# Altium project Soldering_Station_V2.0.PrjPcb
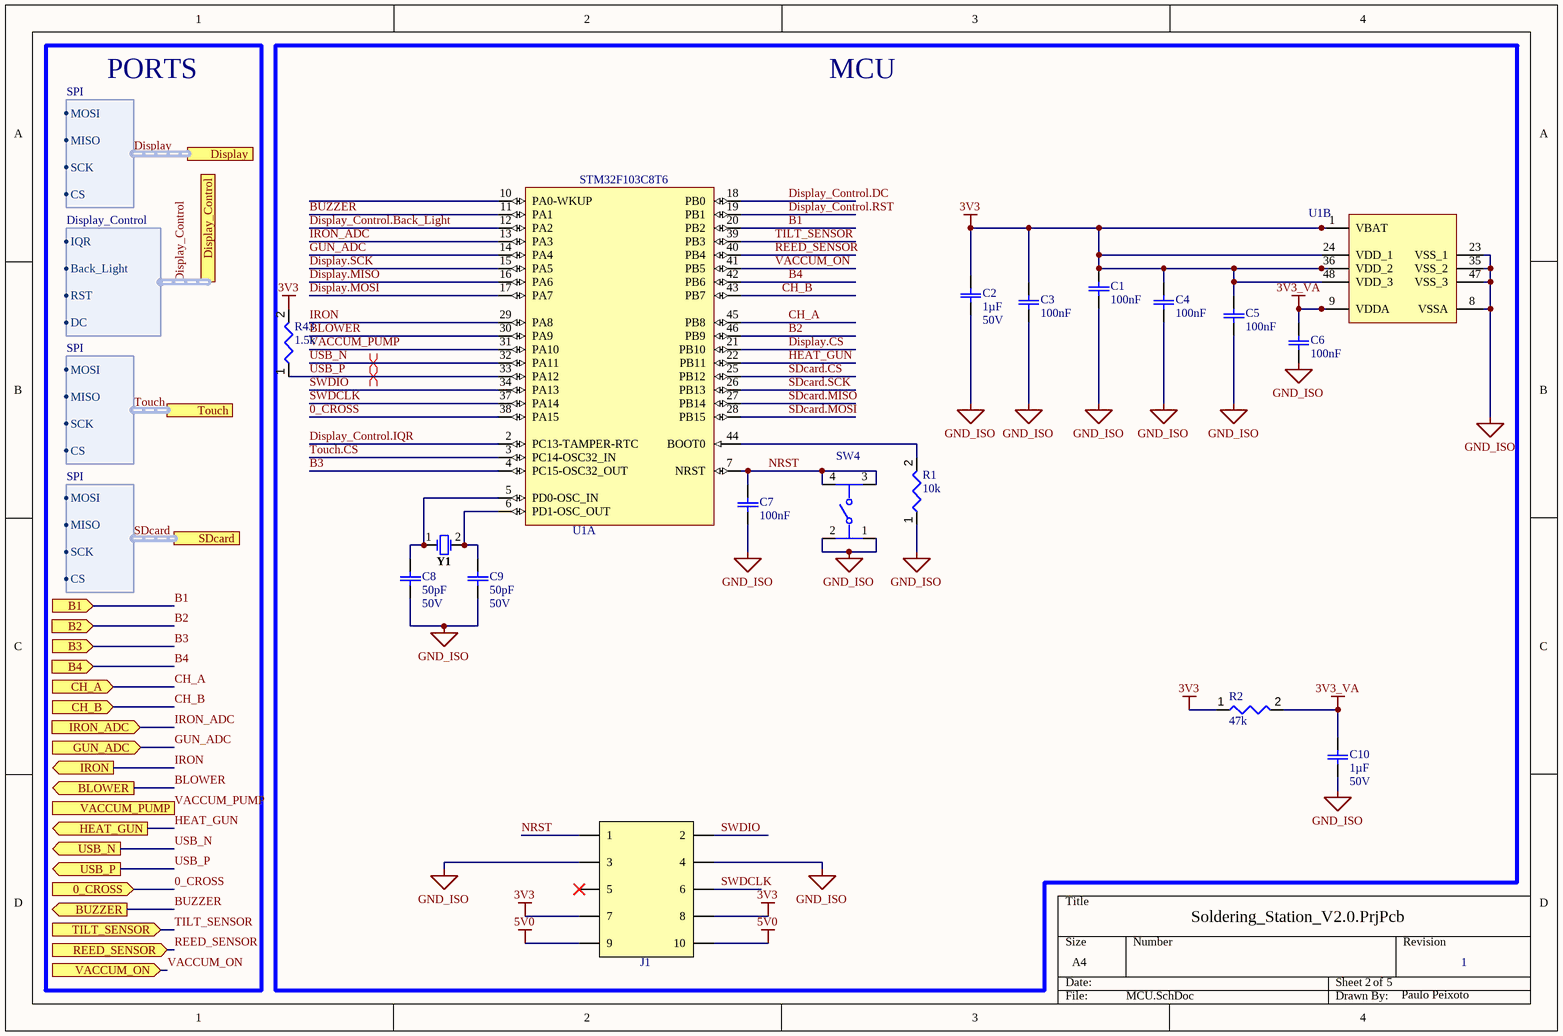
[diagram p0: MCU.SchDoc]
3 sheets, 72 parts. Net scope: flat (ports and power ports of the same name join across sheets).
Board file: PCB1.PcbDoc
Sheets:
  MCU.SchDoc
  Connectivity.SchDoc
  Temperature_Sensing.SchDoc

## Sheet MCU.SchDoc: Soldering Station
size A4; Author: Paulo Peixoto; Revision: 1; SheetNumber: 2; SheetTotal: 5

### Parts
C1  value 100nF  [Generic Ceramic 0402 CAP]  (hidden comment: CAP-MLCC_SMD-0402_MR-GCM_n_100nF_50V_10%_X7R)
C2  value 1µF  Voltage Rating: 50V  [Generic Ceramic 0603 CAP]  (hidden comment: CAP-MLCC_SMD-0603_MR-GRT_u_1uF_50V_10%_X5R)
C3  value 100nF  [Generic Ceramic 0402 CAP]  (hidden comment: CAP-MLCC_SMD-0402_MR-GCM_n_100nF_50V_10%_X7R)
C4  value 100nF  [Generic Ceramic 0402 CAP]  (hidden comment: CAP-MLCC_SMD-0402_MR-GCM_n_100nF_50V_10%_X7R)
C5  value 100nF  [Generic Ceramic 0402 CAP]  (hidden comment: CAP-MLCC_SMD-0402_MR-GCM_n_100nF_50V_10%_X7R)
C6  value 100nF  [Generic Ceramic 0402 CAP]  (hidden comment: CAP-MLCC_SMD-0402_MR-GCM_n_100nF_50V_10%_X7R)
C7  value 100nF  [Generic Ceramic 0402 CAP]  (hidden comment: CAP-MLCC_SMD-0402_MR-GCM_n_100nF_50V_10%_X7R)
C8  value 50pF  Voltage Rating: 50V  [Generic Ceramic 0603 CAP]  (hidden comment: CAP-MLCC_SMD-0603_YGE-CC_p_50pF_50V_5%_C0G)
C9  value 50pF  Voltage Rating: 50V  [Generic Ceramic 0603 CAP]  (hidden comment: CAP-MLCC_SMD-0603_YGE-CC_p_50pF_50V_5%_C0G)
C10  value 1µF  Voltage Rating: 50V  [Generic Ceramic 0603 CAP]  (hidden comment: CAP-MLCC_SMD-0603_MR-GRT_u_1uF_50V_10%_X5R)
J1  302-S101  [FP-302-S101-MFG]  (value not drawn)
R1  value 10k  [Generic_0603_RES]  (hidden comment: RES-TK_SMD-0603_VIS-CRCW_K_10K_1/10W_1%)
R2  value 47k  [Generic_0603_RES]  (hidden comment: RES-TK_SMD-0603_VIS-CRCW_K_47K_1/10W_1%)
R43  value 1.5k  [Generic_0402__RES]  (hidden comment: RES-TK_SMD-0402_VIS-CRCW_K_1.5K_1/10W_1%)
SW4  TL1105AF160Q  [FP-TL1105AF160Q-MFG]  (value not drawn)
U1  STM32F103C8T6  [STM-LQFP48_L]  (parts A,B of 2)
Y1  FOXSLF/080-20  [FOX-FOXSLF080-20]  (value not drawn)

### Blocks framed on the sheet
MCU: C1-C10 J1 R1 R2 R43 SW4 U1 Y1

### Ports
0_CROSS (in, see 1[6B], 4[1B]), B1 (in, see 1[4B], 3[1B]), B2 (in, see 1[4B], 3[1B]), B3 (in, see 1[4B], 3[1B]), B4 (in, see 1[4B], 3[1B]), BLOWER (out, see 1[6B], 4[1A]), BUZZER (out, see 1[4B], 3[1C]), CH_A (in, see 1[4B], 3[1B]), CH_B (in, see 1[4B], 3[1C]), Display (harness SPI, see 1[5B], 3[1A]), Display_Control (harness Display_Control, see 1[5B], 3[2A]), GUN_ADC (in, see 1[4C], 5[4C]), HEAT_GUN (out, see 1[6B], 4[1A]), IRON (out, see 1[6B], 4[1A]), IRON_ADC (in, see 1[4C], 5[4A]), REED_SENSOR (in, see 1[5C]), SDcard (harness SPI, see 1[5B], 3[1B]), TILT_SENSOR (in, see 1[5C]), Touch (harness SPI, see 1[5B], 3[1B]), USB_N (out, see 1[4B], 3[1C]), USB_P (out, see 1[4B], 3[1C]), VACCUM_ON (in, see 1[5C]), VACCUM_PUMP (out, see 1[6B], 4[1A])

### Harnesses
SPI: MOSI, MISO, SCK, CS
Display_Control: IQR, Back_Light, RST, DC

### Nets
3V3: C1.2 C2.2 C3.2 C4.2 C5.2 J1.7 J1.8 R2.1 R43.2 U1.1(VBAT) U1.24(VDD_1) U1.36(VDD_2) U1.48(VDD_3)
3V3_VA: C6.2 C10.2 R2.2 U1.9(VDDA)
5V0: J1.9 J1.10
GND_ISO: C1.1 C2.1 C3.1 C4.1 C5.1 C6.1 C7.1 C8.2 C9.2 C10.1 J1.3 J1.4 R1.1 SW4.1 SW4.2 U1.8(VSSA) U1.23(VSS_1) U1.35(VSS_2) U1.47(VSS_3)
0_CROSS: U1.38(PA15) ; port 0_CROSS
B1: U1.20(PB2) ; port B1
B2: U1.46(PB9) ; port B2
B3: U1.4(PC15-OSC32_OUT) ; port B3
B4: U1.42(PB6) ; port B4
BLOWER: U1.30(PA9) ; port BLOWER
BUZZER: U1.11(PA1) ; port BUZZER
CH_A: U1.45(PB8) ; port CH_A
CH_B: U1.43(PB7) ; port CH_B
Display.CS: U1.21(PB10)
Display.MISO: U1.16(PA6)
Display.MOSI: U1.17(PA7)
Display.SCK: U1.15(PA5)
Display_Control.Back_Light: U1.12(PA2)
Display_Control.DC: U1.18(PB0)
Display_Control.IQR: U1.2(PC13-TAMPER-RTC)
Display_Control.RST: U1.19(PB1)
GUN_ADC: U1.14(PA4) ; port GUN_ADC
HEAT_GUN: U1.22(PB11) ; port HEAT_GUN
IRON: U1.29(PA8) ; port IRON
IRON_ADC: U1.13(PA3) ; port IRON_ADC
NRST: C7.2 J1.1 SW4.3 SW4.4 U1.7(NRST)
REED_SENSOR: U1.40(PB4) ; port REED_SENSOR
SDcard.CS: U1.25(PB12)
SDcard.MISO: U1.27(PB14)
SDcard.MOSI: U1.28(PB15)
SDcard.SCK: U1.26(PB13)
SWDCLK: J1.6 U1.37(PA14)
SWDIO: J1.2 U1.34(PA13)
TILT_SENSOR: U1.39(PB3) ; port TILT_SENSOR
Touch.CS: U1.3(PC14-OSC32_IN)
USB_N: U1.32(PA11) ; port USB_N
USB_P: R43.1 U1.33(PA12) ; port USB_P
VACCUM_ON: U1.41(PB5) ; port VACCUM_ON
VACCUM_PUMP: U1.31(PA10) ; port VACCUM_PUMP
NetC8_1: C8.1 U1.5(PD0-OSC_IN) Y1.1
NetC9_1: C9.1 U1.6(PD1-OSC_OUT) Y1.2
NetR1_2: R1.2 U1.44(BOOT0)

Not connected (* = marked no-connect by the designer): J1 5*; U1 10(PA0-WKUP)

### Buses and harness runs
harness Display = port Display
harness Display_Control = port Display_Control
harness SDcard = port SDcard
harness Touch = port Touch

### Layout directives
differential pair: USB_N, USB_P

### Notes on the sheet
- PORTS

### Library data of the parts
C1 C3-C7 = CMP-001-00170-1: Ceramic Capacitor, Ceramic, 50V, 10% +Tol, 10% -Tol, X7R, 15% TC, 0.1uF, Surface Mount, 0402; Mounting Technology: Surface Mount; RoHS Compliant: Yes; Capacitor Type: Ceramic; Min Operating Temperature: -55°C; Case/Package: 0402; Max Operating Temperature: 125°C; Pins: 2
C2 C10 = CMP-001-00191-2: Multilayer Ceramic Capacitors MLCC - SMD/SMT 0603 50Vdc 1.0uF X5R 10%; Case/Package: 0603; Tolerance: 10%; Min Operating Temperature: -55°C; Capacitor Type: Ceramic; Pins: 2; RoHS Compliant: Yes; Mounting Technology: Surface Mount; Automotive: AEQ-200; Max Operating Temperature: 85°C; Dielectric: X5R
C8 C9 = CMP-001-00198-1: Surface Mount Ceramic Multilayer Capacitor 50pF 5% C0G 50V 0603 Paper T/R; Dielectric: COG; Case/Package: 0603; Min Operating Temperature: -55°C; RoHS Compliant: Yes; Automotive: NONE; Capacitor Type: Ceramic; Mounting Technology: Surface Mount; Max Operating Temperature: 125°C; Pins: 2
J1 = CMP-001-0100-1: Conn Shrouded Header (4 Sides) HDR 10 POS 2.54mm Solder ST Thru-Hole; Current Rating: 3A; Connector Type: Male Pin; Number of Contacts: 10; Contact Resistance: 20mΩ; Insulation Resistance: 1GΩ; Terminal Pitch: 2.54mm; RoHS: Compliant; REACH SVHC: Yes; Contact Gender: Male; Row Spacing: 2.54mm; Contact Material: Brass; Number of Rows: 2; Max Operating Temperature: 105°C; Color: Black; Pitch: 2.54mm; Contact Plating: Gold; Number of Positions: 10; Termination: Solder; Mounting Technology: Through Hole; Lifecycle Status: Production; Min Operating Temperature: -40°C; Pins: 10; Height: 9.15mm
R1 = CMP-009-00246-1: Fixed Resistor, Metal Glaze/thick Film, 0.1W, 10000ohm, 75V, 1% +/-Tol, 100ppm/Cel, Surface Mount, 0603; Power: 100mW; Mounting Technology: Surface Mount; Pins: 2; Min Operating Temperature: -55°C; Tolerance: 1%; RoHS Compliant: Yes; Max Operating Temperature: 155°C; Case/Package: 0603; Voltage Rating: 75V
R2 = CMP-009-00207-2: Fixed Resistor, Metal Glaze/thick Film, 0.1W, 47000ohm, 75V, 1% +/-Tol, 100ppm/Cel, Surface Mount, 0603; Power: 100mW; Case/Package: 0603; Max Operating Temperature: 155°C; Voltage Rating: 75V; RoHS Compliant: Yes; Min Operating Temperature: -55°C; Tolerance: 1%; Mounting Technology: Surface Mount; Pins: 2
R43 = CMP-009-00006-1: Surface Mount Thick Film Resistor, AEC-Q200 CRCW Series, 1.5 kohm, 125 mW, - 1%, 50 V; Power Rating: 125mW; Voltage Rating: 50V; Pins: 2; Case Code (Imperial): 0402; Max Operating Temperature: 155°C; Composition: Thick Film; REACH SVHC: Unknown; RoHS: Compliant; Min Operating Temperature: -55°C; Tolerance: 1%; Voltage Rating (DC): 50V; Case Code (Metric): 1005; Packaging: Cut Tape; Width: 1mm; Lead Free: Lead Free; Case/Package: 0402
SW4 = CMP-17879-000016-1: SWITCH TACTILE SPST-NO 0.05A 12V; Mechanical Life: 100000Cycles; Contact Current Rating: 50mA; Contact Resistance: 100mR; Switch Function: Off-Mom; Actuator Type: Standard; Actuator Length: 1.4mm; Max Voltage Rating (DC): 50V; Throw Configuration: SPST; Actuator Material: Nylon; Illumination Type: Non-Illuminated; Switch Travel: 0.25mm; Operating Force: 160gf; Package Quantity: 750; Width: 6mm; Series: TL1105; Voltage Rating (DC): 12V; Length: 6mm; Contact Plating: Silver; Color: Black; Housing Material: Nylon; Min Operating Temperature: -20°C; Lead Free: Lead Free; Mount: Through Hole; Termination: PC Pin; RoHS Compliant: Yes; Orientation: Straight; Max Operating Temperature: 70°C; Reach SVHC Compliant: Yes; Packaging: Bulk; Electrical Life: 100000Cycles; Current Rating: 50mA; Contact Material: Bronze; Size: 6mm
U1 = CMP-0237-00215-3: ARM Cortex-M3 32-bit MCU, 64 KB Flash, 20 KB Internal RAM, 37 I/Os, 48-pin LQFP, -40 to 85 degC, Tray; Supply Voltage(Vcc) min (V): 2; Internal RAM Size (kB): 20; FLASH Size (Prog) (kB): 64; A/D Converter: 2x12-bit (10 Channel); I/Os (High Current): 37; Operating Frequency(F) (Processor speed) (MHz): 72; Core: ARM Cortex-M3; ComponentLink3Description: Package Specification; Mounting Technology: Surface Mount; PartNumber: STM32F103C8T6; PackageReference: LQFP48; Packing: Tray; ComponentLink3URL: http://www.st.com/st-web-ui/static/active/en/resource/technical/document/datasheet/DM00058181.pdf; DatasheetVersion: Rev. 16; ComponentLink1URL: http://www.st.com/web/en/home.html; PackageVersion: Rev. 6, 06/2013; ComponentLink2URL: http://www.st.com/st-web-ui/static/active/en/resource/technical/document/datasheet/CD00161566.pdf; ComponentLink1Description: Manufacturer URL; ComponentLink2Description: Datasheet; PackageDescription: 48-Pin Low Profile Quad Flat Package, 7 x 7 mm Body, 0.5 mm Pitch
Y1 = CMP-1749-00002-1: Resistance Weld Thru-Hole Crystal, 8 MHz, -20 to 70 degC, 2-Pin THD, RoHS, Bulk; Dropout Voltage: 2 V; Outputs: 1; Nominal Output Voltage: 5 V; Min Input Voltage: 7 V; Case\Package: TO-263-3; Max Input Voltage: 35 V; Max Ouput Current: 1 A; Length: 10.24 mm; Max Operating Temperature: 125 degC; Mount: Surface Mount; PackageDescription: 2-Pin Through Hole Device, Body 11.35 x 4.65 mm; Package Quantity: 50; Pins: 3; ComponentLink2URL: http://download.siliconexpert.com/pdfs/2015/4/5/6/5/7/200/fox_/manual/35607121449963728hc49slf.pdf; PackageReference: FOXSLF080-20; Min Operating Temperature: 0 degC; Height: 30.02 mm; Packaging: Rail/Tube; Radiation Hardening: No; Width: 9.35 mm; ComponentLink1URL: http://www.foxonline.com/; DatasheetVersion: Mar-15; ComponentLink1Description: Manufacturer URL; Output Voltage: 5 V; RoHSCompliant: true; REACH SVHC: No SVHC; Output Current: 1 A; ComponentLink2Description: Datasheet

## Sheet Connectivity.SchDoc: =@Title
size A3; Author: Paulo Peixoto; DrawnBy: Paulo Peixoto; Engineer: Paulo Peixoto; SheetNumber: 3; SheetTotal: 5
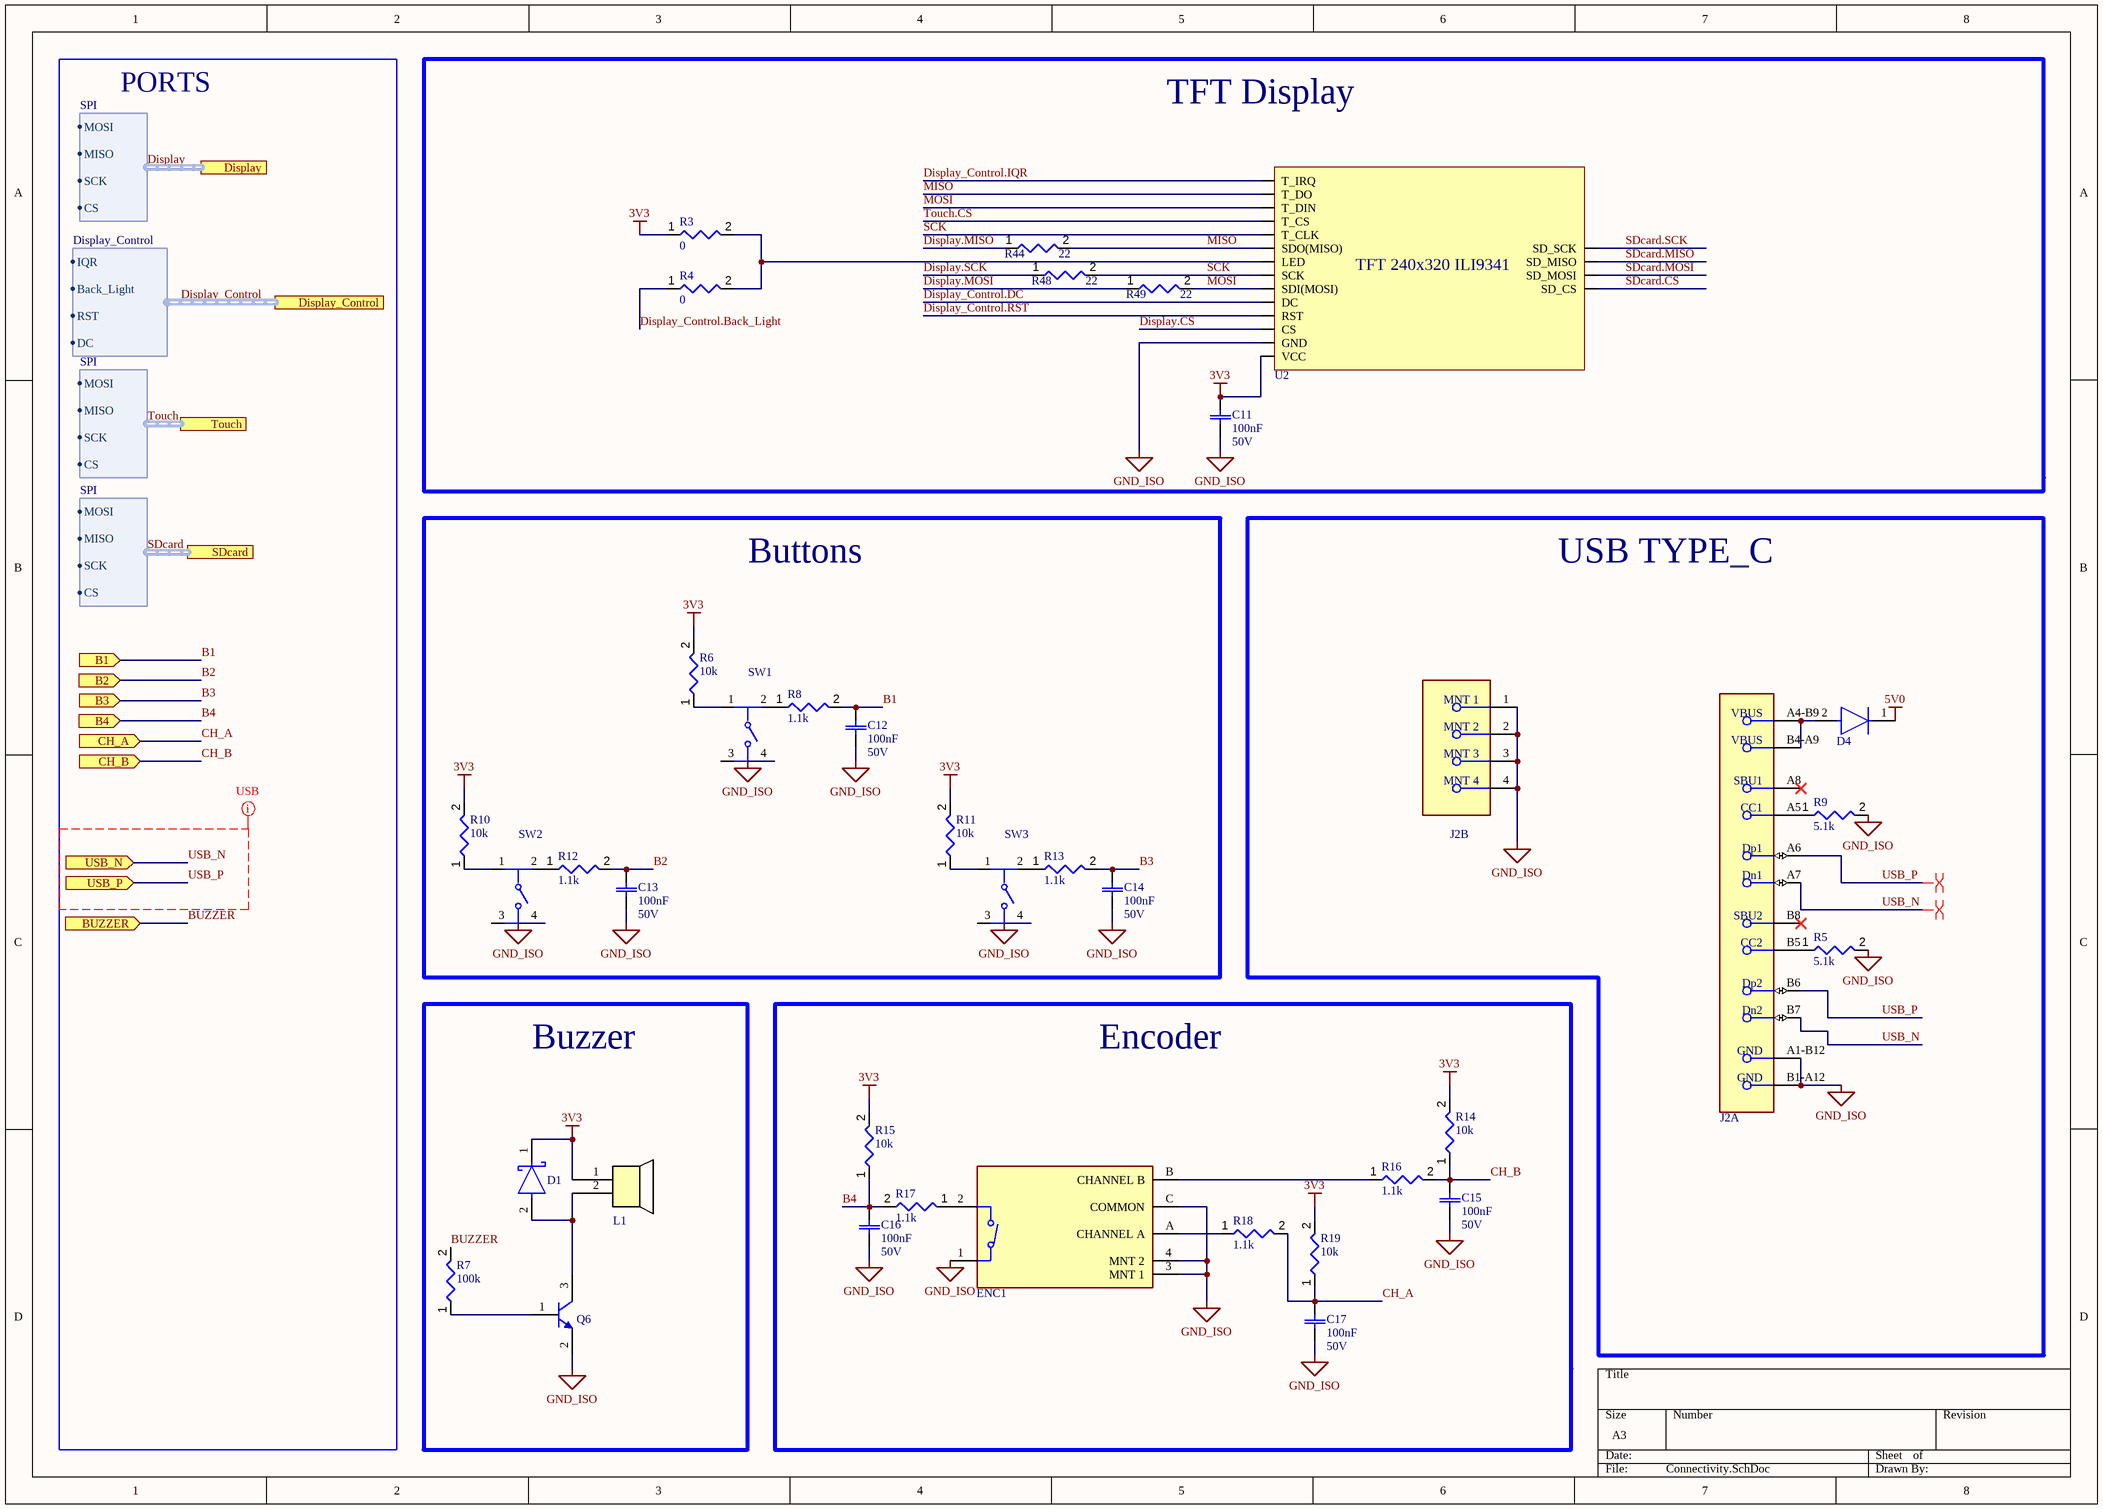
[diagram p1: Connectivity.SchDoc]

### Parts
C11  value 100nF  Voltage Rating: 50V  [Generic Ceramic 0603 CAP]  (hidden comment: CAP-MLCC_SMD-0603_MR-GCM_u_0.1uF_50V_10%_X8L)
C12  value 100nF  Voltage Rating: 50V  [Generic Ceramic 0603 CAP]  (hidden comment: CAP-MLCC_SMD-0603_MR-GCM_u_0.1uF_50V_10%_X8L)
C13  value 100nF  Voltage Rating: 50V  [Generic Ceramic 0603 CAP]  (hidden comment: CAP-MLCC_SMD-0603_MR-GCM_u_0.1uF_50V_10%_X8L)
C14  value 100nF  Voltage Rating: 50V  [Generic Ceramic 0603 CAP]  (hidden comment: CAP-MLCC_SMD-0603_MR-GCM_u_0.1uF_50V_10%_X8L)
C15  value 100nF  Voltage Rating: 50V  [Generic Ceramic 0603 CAP]  (hidden comment: CAP-MLCC_SMD-0603_MR-GCM_u_0.1uF_50V_10%_X8L)
C16  value 100nF  Voltage Rating: 50V  [Generic Ceramic 0603 CAP]  (hidden comment: CAP-MLCC_SMD-0603_MR-GCM_u_0.1uF_50V_10%_X8L)
C17  value 100nF  Voltage Rating: 50V  [Generic Ceramic 0603 CAP]  (hidden comment: CAP-MLCC_SMD-0603_MR-GCM_u_0.1uF_50V_10%_X8L)
D1  DIO-SHOTTKY_SMD_OD-214AC_TWS-1A_100V  [DIO-SHOTTKY_SMD_OD-214AC_TWS-1A_100V-Footprint-1]  (value not drawn)
D4  RS1A  [FP-403AE-MFG]  (value not drawn)
ENC1  PEC11R-4020F-S0012  [FP-PEC11R-4020F-S0012-MFG]  (value not drawn)
J2  217179-0001  [FP-2171790001-MFG]  (value not drawn)  (parts A,B of 2)
L1  TMB12A05  [TMB12A05-Footprint-1]  (value not drawn)
Q6  SMMBT2222ALT1G  [ONSC-SOT-23-3-318-08_V]  (value not drawn)
R3  value 0  [Generic_0603_RES]  (hidden comment: RES-TK_SMD-0603_VIS-CRCW_R_0R_1/10W_1%)
R4  value 0  [Generic_0603_RES]  (hidden comment: RES-TK_SMD-0603_VIS-CRCW_R_0R_1/10W_1%)
R5  value 5.1k  [Generic_0603_RES]  (hidden comment: RES-TK_SMD-0603_VIS-CRCW_K_5.1K_1/10W_1%)
R6  value 10k  [Generic_0603_RES]  (hidden comment: RES-TK_SMD-0603_VIS-CRCW_K_10K_1/10W_1%)
R7  value 100k  [Generic_0603_RES]  (hidden comment: RES-TK_SMD-0603_VIS-CRCW_K_100K_1/10W_1%)
R8  value 1.1k  [Generic_0603_RES]  (hidden comment: RES-TK_SMD-0603_VIS-CRCW_K_1.1K_1/10W_1%)
R9  value 5.1k  [Generic_0603_RES]  (hidden comment: RES-TK_SMD-0603_VIS-CRCW_K_5.1K_1/10W_1%)
R10  value 10k  [Generic_0603_RES]  (hidden comment: RES-TK_SMD-0603_VIS-CRCW_K_10K_1/10W_1%)
R11  value 10k  [Generic_0603_RES]  (hidden comment: RES-TK_SMD-0603_VIS-CRCW_K_10K_1/10W_1%)
R12  value 1.1k  [Generic_0603_RES]  (hidden comment: RES-TK_SMD-0603_VIS-CRCW_K_1.1K_1/10W_1%)
R13  value 1.1k  [Generic_0603_RES]  (hidden comment: RES-TK_SMD-0603_VIS-CRCW_K_1.1K_1/10W_1%)
R14  value 10k  [Generic_0603_RES]  (hidden comment: RES-TK_SMD-0603_VIS-CRCW_K_10K_1/10W_1%)
R15  value 10k  [Generic_0603_RES]  (hidden comment: RES-TK_SMD-0603_VIS-CRCW_K_10K_1/10W_1%)
R16  value 1.1k  [Generic_0603_RES]  (hidden comment: RES-TK_SMD-0603_VIS-CRCW_K_1.1K_1/10W_1%)
R17  value 1.1k  [Generic_0603_RES]  (hidden comment: RES-TK_SMD-0603_VIS-CRCW_K_1.1K_1/10W_1%)
R18  value 1.1k  [Generic_0603_RES]  (hidden comment: RES-TK_SMD-0603_VIS-CRCW_K_1.1K_1/10W_1%)
R19  value 10k  [Generic_0603_RES]  (hidden comment: RES-TK_SMD-0603_VIS-CRCW_K_10K_1/10W_1%)
R44  value 22  [Generic_0603_RES]  (hidden comment: RES-TK_SMD-0603_VIS-CRCW_R_22R_1/10W_1%)
R48  value 22  [Generic_0603_RES]  (hidden comment: RES-TK_SMD-0603_VIS-CRCW_R_22R_1/10W_1%)
R49  value 22  [Generic_0603_RES]  (hidden comment: RES-TK_SMD-0603_VIS-CRCW_R_22R_1/10W_1%)
SW1  TL1105AF160Q  [FP-TL1105AF160Q-MFG]  (value not drawn)
SW2  TL1105AF160Q  [FP-TL1105AF160Q-MFG]  (value not drawn)
SW3  TL1105AF160Q  [FP-TL1105AF160Q-MFG]  (value not drawn)
U2  TFT 240x320 SPI  [TFT ILI9341 2.4inch]  (value not drawn)

### Blocks framed on the sheet
TFT Display: C11 R3 R4 R44 R48 R49 U2
Buttons: C12-C14 R6 R8 R10-R13 SW1-SW3
USB TYPE_C: D4 J2 R5 R9
Buzzer: D1 L1 Q6 R7
Encoder: C15-C17 ENC1 R14-R19

### Ports
B1 (in, see 1[4B], 2[1C]), B2 (in, see 1[4B], 2[1C]), B3 (in, see 1[4B], 2[1C]), B4 (in, see 1[4A], 2[1C]), BUZZER (in, see 1[4B], 2[1D]), CH_A (in, see 1[4A], 2[1C]), CH_B (in, see 1[4A], 2[1C]), Display (harness SPI, see 1[5B], 2[1A]), Display_Control (harness Display_Control, see 1[5B], 2[1B]), SDcard (harness SPI, see 1[5B], 2[1C]), Touch (harness SPI, see 1[5B], 2[1B]), USB_N (in, see 1[4A], 2[1D]), USB_P (in, see 1[4A], 2[1D])

### Harnesses
SPI: MOSI, MISO, SCK, CS
Display_Control: IQR, Back_Light, RST, DC

### Nets
3V3: C11.2 D1.1(C) L1.1 R3.1 R6.2 R10.2 R11.2 R14.2 R15.2 R19.2 U2.1(VCC)
5V0: D4.1(C)
GND_ISO: C11.1 C12.1 C13.1 C14.1 C15.1 C16.1 C17.1 ENC1.1 ENC1.3(MNT_1) ENC1.4(MNT_2) ENC1.C(COMMON) J2.1(MNT_1) J2.2(MNT_2) J2.3(MNT_3) J2.4(MNT_4) J2.A1-B12(GND) J2.B1-A12(GND) Q6.2(E) R5.2 R9.2 SW1.4 SW2.4 SW3.4 U2.2(GND)
B1: C12.2 R8.2 ; port B1
B2: C13.2 R12.2 ; port B2
B3: C14.2 R13.2 ; port B3
B4: C16.2 R15.1 R17.2 ; port B4
BUZZER: R7.2 ; port BUZZER
CH_A: C17.2 R18.2 R19.1 ; port CH_A
CH_B: C15.2 R14.1 R16.2 ; port CH_B
Display.CS: U2.3(CS)
Display.MISO: R44.1
Display.MOSI: R49.1
Display.SCK: R48.1
Display_Control.Back_Light: R4.1
Display_Control.DC: U2.5(DC)
Display_Control.IQR: U2.14(T_IRQ)
Display_Control.RST: U2.4(RST)
MISO: R44.2 U2.9(SDO(MISO)) U2.13(T_DO)
MOSI: R49.2 U2.6(SDI(MOSI)) U2.12(T_DIN)
SCK: R48.2 U2.7(SCK) U2.10(T_CLK)
SDcard.CS: U2.18(SD_CS)
SDcard.MISO: U2.16(SD_MISO)
SDcard.MOSI: U2.17(SD_MOSI)
SDcard.SCK: U2.15(SD_SCK)
Touch.CS: U2.11(T_CS)
USB_N: J2.A7(Dn1) J2.B7(Dn2) ; port USB_N
USB_P: J2.A6(Dp1) J2.B6(Dp2) ; port USB_P
NetD1_2: D1.2(A) L1.2 Q6.3(C)
NetD4_2: D4.2(A) J2.A4-B9(VBUS) J2.B4-A9(VBUS)
NetENC1_2: ENC1.2 R17.1
NetENC1_A: ENC1.A(CHANNEL_A) R18.1
NetENC1_B: ENC1.B(CHANNEL_B) R16.1
NetJ2_A5: J2.A5(CC1) R9.1
NetJ2_B5: J2.B5(CC2) R5.1
NetQ6_1: Q6.1(B) R7.1
NetR3_2: R3.2 R4.2 U2.8(LED)
NetR6_1: R6.1 SW1.1
NetR8_1: R8.1 SW1.2
NetR10_1: R10.1 SW2.1
NetR11_1: R11.1 SW3.1
NetR12_1: R12.1 SW2.2
NetR13_1: R13.1 SW3.2

Not connected (* = marked no-connect by the designer): J2 A8(SBU1)* B8(SBU2)*; SW1 3; SW2 3; SW3 3

### Buses and harness runs
harness Display = port Display
harness Display_Control = port Display_Control
harness SDcard = port SDcard
harness Touch = port Touch

### Layout directives
differential pair: USB_N, USB_P
net class USB: USB_N, USB_P

### Notes on the sheet
- PORTS
- (in symbol CMP-001-0162-3) TFT 240x320 ILI9341

### Library data of the parts
C11-C17 = CMP-001-00115-11: Ceramic Capacitor, Multilayer, Ceramic, 50V, 10% +Tol, 10% -Tol, X8L, -40/+15% TC, 0.1uF, Surface Mount, 0603; Automotive: AEQ-200; Min Operating Temperature: -55°C; Case/Package: 0603; Mounting Technology: Surface Mount; RoHS Compliant: Yes; Capacitor Type: Ceramic; Pins: 2; Max Operating Temperature: 150°C
D1 = CMP-001-0168-2: Rectifier Diode, Schottky, 1 Phase, 1 Element, 1A, 100V V(RRM), Silicon, DO-214AC; Manufacturer Lifecycle Status: ACTIVE; Manufacturer Part Number: SS110; Peak Reverse Current: 2mA; Peak Non-Repetitive Surge Current: 40A; Element Configuration: Single; Forward Voltage: 800mV; Rep Pk Reverse Voltage-Max: 150V; Number of Elements: 1; Reference Standard: AEC-Q101; Max Repetitive Reverse Voltage (Vrrm): 100V; Mounting Technology: Surface Mount; REACH SVHC: No; Case/Package: SMA; Reach SVHC Compliant: Yes; Max Operating Temperature: 150°C; Height: 2.3mm; Lifecycle Status: Production; Length: 4.6mm; Max Forward Surge Current (Ifsm): 40A; Min Operating Temperature: -55°C; Width: 2.83mm; RoHS Compliant: Yes; Forward Current: 1A; Max Output current: 1A; Reverse Standoff Voltage: 100V; Number of Terminals: 2; RoHS: Compliant; Pins: 2
D4 = CMP-001-0173-1: Diode Fast Recovery Rectifier 50V 1A 2-Pin DO-214AC T/R; Manufacturer Lifecycle Status: ACTIVE; Value: 10pF; Peak Non-Repetitive Surge Current: 30A; Recovery Time: 150ns; Max Power Dissipation: 1.19W; Number of Elements: 1; Polarity: Standard; Forward Voltage: 1.3V; Element Configuration: Single; Peak Reverse Current: 5µA; Max Repetitive Reverse Voltage (Vrrm): 50V; Min Operating Temperature: -55°C; Reverse Standoff Voltage: 50V; Mounting Technology: Surface Mount; Voltage Rating (DC): 50V; Current Rating: 1A; Case/Package: SMA; REACH SVHC: No; Reverse Recovery Time: 150ns; Max Operating Temperature: 150°C; Average Rectified Current: 1A; Radiation Hardening: No; Weight: 106mg; Max Reverse Voltage (DC): 50V; Forward Current: 1A; Length: 4.75mm; Pins: 2; RoHS: Compliant; Lead Free: Lead Free; Width: 2.95mm; Number of Terminals: 2; Output Current: 1A; Max Output current: 1A; Packaging: Cut Tape; China RoHS: Non-Compliant; Power Dissipation: 1.19W; Schedule B: 8541100080, 8541100080; Max Surge Current: 30A; Reverse Voltage: 50V; Height: 2.2mm; Max Forward Surge Current (Ifsm): 30A; Lifecycle Status: Production
ENC1 = CMP-07421-000045-1: ROTARY ENCODER MECHANICAL 12PPR; Built in Switch: Yes; Pulses per Revolution: 12; Number of Channels: 2; Detent: No; Output Type: Quadrature; Min Operating Temperature: -30°C; Height: 13.4mm; Orientation: Vertical; Max Operating Temperature: 70°C; Mount: Through Hole; Termination: PC Pin; Encoder Type: Mechanical; Width: 12.5mm; RoHS Compliant: Yes; Package Quantity: 150; Packaging: Bulk; Length: 26.5mm; Series: PEC11R
J2 = CMP-04767-000028-2: CONN RCP USB2.0 TYP C 24P SMD RA; NexarPartId: 117190526; Gender: Receptacle; Number of Contacts: 16; Current Rating: 1.25A; Voltage Rating: 30V; Min Operating Temperature: -40°C; USB Standard: USB 2.0; Height: 3.36mm; Contact Material: Gold, Nickel; Max Operating Temperature: 85°C
L1 = CMP-001-0165-1: 88dB Active (Built-in Driver Circuit) Electromagnetic Type 2.4kHz Plugin, D=12mm Buzzers ROHS
Q6 = CMP-1048-00591-1: General Purpose Transistor, NPN Silicon, 3-Pin SOT-23, Pb-Free, Tape and Reel; Manufacturer: On Semiconductor; fT Min (MHz): 300; IC Continuous (A): 0.6; Mounting Technology: Surface Mount; ComponentLink1URL: http://www.onsemi.com/; Polarity: NPN; PackageDescription: 3-Pin Small Outline Transistor, Body 2.92 x 1.3 mm, Pitch 0.95 mm; RoHS: TRUE; DatasheetVersion: Rev. 10; Packing: Tape and Reel; PackageVersion: Rev. AP, 11/2009; ComponentLink3Description: Package Specification; PartNumber: SMMBT2222ALT1G; ComponentLink1Description: Manufacturer URL; ComponentLink3URL: http://www.onsemi.cn/pub_link/Collateral/318-08.PDF; PackageReference: SOT-23-3-318-08; ComponentLink2Description: Datasheet; ComponentLink2URL: http://www.onsemi.cn/pub_link/Collateral/MMBT2222LT1-D.PDF
R3 R4 = CMP-009-00217-3: Resistor SMD 0 Ohm 0603 PU=5000 ST, CRCW06030000Z0EA, Vishay; Tolerance: 1%; Voltage Rating: 75V; Power: 100mW; Min Operating Temperature: -55°C; Mounting Technology: Surface Mount; Pins: 2; Max Operating Temperature: 155°C; Case/Package: 0603; RoHS Compliant: Yes
R5 R9 = CMP-009-00305-1: Fixed Resistor, Metal Glaze/thick Film, 0.1W, 5100ohm, 75V, 1% +/-Tol, 100ppm/Cel, Surface Mount, 0603; Power: 100mW; Max Operating Temperature: 155°C; Voltage Rating: 75V; Tolerance: 1%; Min Operating Temperature: -55°C; Pins: 2; Mounting Technology: Surface Mount; RoHS Compliant: Yes; Case/Package: 0603
R6 R10 R11 R14 R15 R19 = CMP-009-00246-1: as R1 on sheet MCU; Mounting Technology: Surface Mount; Pins: 2; Min Operating Temperature: -55°C; Tolerance: 1%; RoHS Compliant: Yes; Max Operating Temperature: 155°C; Case/Package: 0603; Voltage Rating: 75V
R7 = CMP-009-00230-4: Fixed Resistor, Metal Glaze/thick Film, 0.1W, 100000ohm, 75V, 1% +/-Tol, 100ppm/Cel, Surface Mount, 0603; Power: 100mW; Pins: 2; Max Operating Temperature: 155°C; Mounting Technology: Surface Mount; Case/Package: 0603; RoHS Compliant: Yes; Voltage Rating: 75V; Tolerance: 1%; Min Operating Temperature: -55°C
R8 R12 R13 R16-R18 = CMP-009-00235-1: Fixed Resistor, Metal Glaze/thick Film, 0.1W, 1100ohm, 75V, 1% +/-Tol, 100ppm/Cel, Surface Mount, 0603; Power: 100mW; Mounting Technology: Surface Mount; Max Operating Temperature: 155°C; RoHS Compliant: Yes; Min Operating Temperature: -55°C; Voltage Rating: 75V; Case/Package: 0603; Tolerance: 1%; Pins: 2
R44 R48 R49 = CMP-009-00275-2: Res Thick Film 0603 22 Ohm 1% 1/10W ±100ppm/°C Molded SMD Paper T/R; Power: 125mW; Voltage Rating: 75V; Case/Package: 0603; Min Operating Temperature: -55°C; Pins: 2; Max Operating Temperature: 155°C; RoHS Compliant: Yes; Mounting Technology: Surface Mount; Tolerance: 1%
SW1-SW3 = CMP-17879-000016-1: as SW4 on sheet MCU; Package Quantity: 750; Width: 6mm; Series: TL1105; Voltage Rating (DC): 12V; Length: 6mm; Contact Plating: Silver; Color: Black; Housing Material: Nylon; Min Operating Temperature: -20°C; Lead Free: Lead Free; Mount: Through Hole; Termination: PC Pin; RoHS Compliant: Yes; Orientation: Straight; Max Operating Temperature: 70°C; Reach SVHC Compliant: Yes; Packaging: Bulk; Electrical Life: 100000Cycles; Current Rating: 50mA; Contact Material: Bronze; Size: 6mm
U2 = CMP-001-0162-3

## Sheet Temperature_Sensing.SchDoc
size A4; SheetNumber: 5; SheetTotal: 6
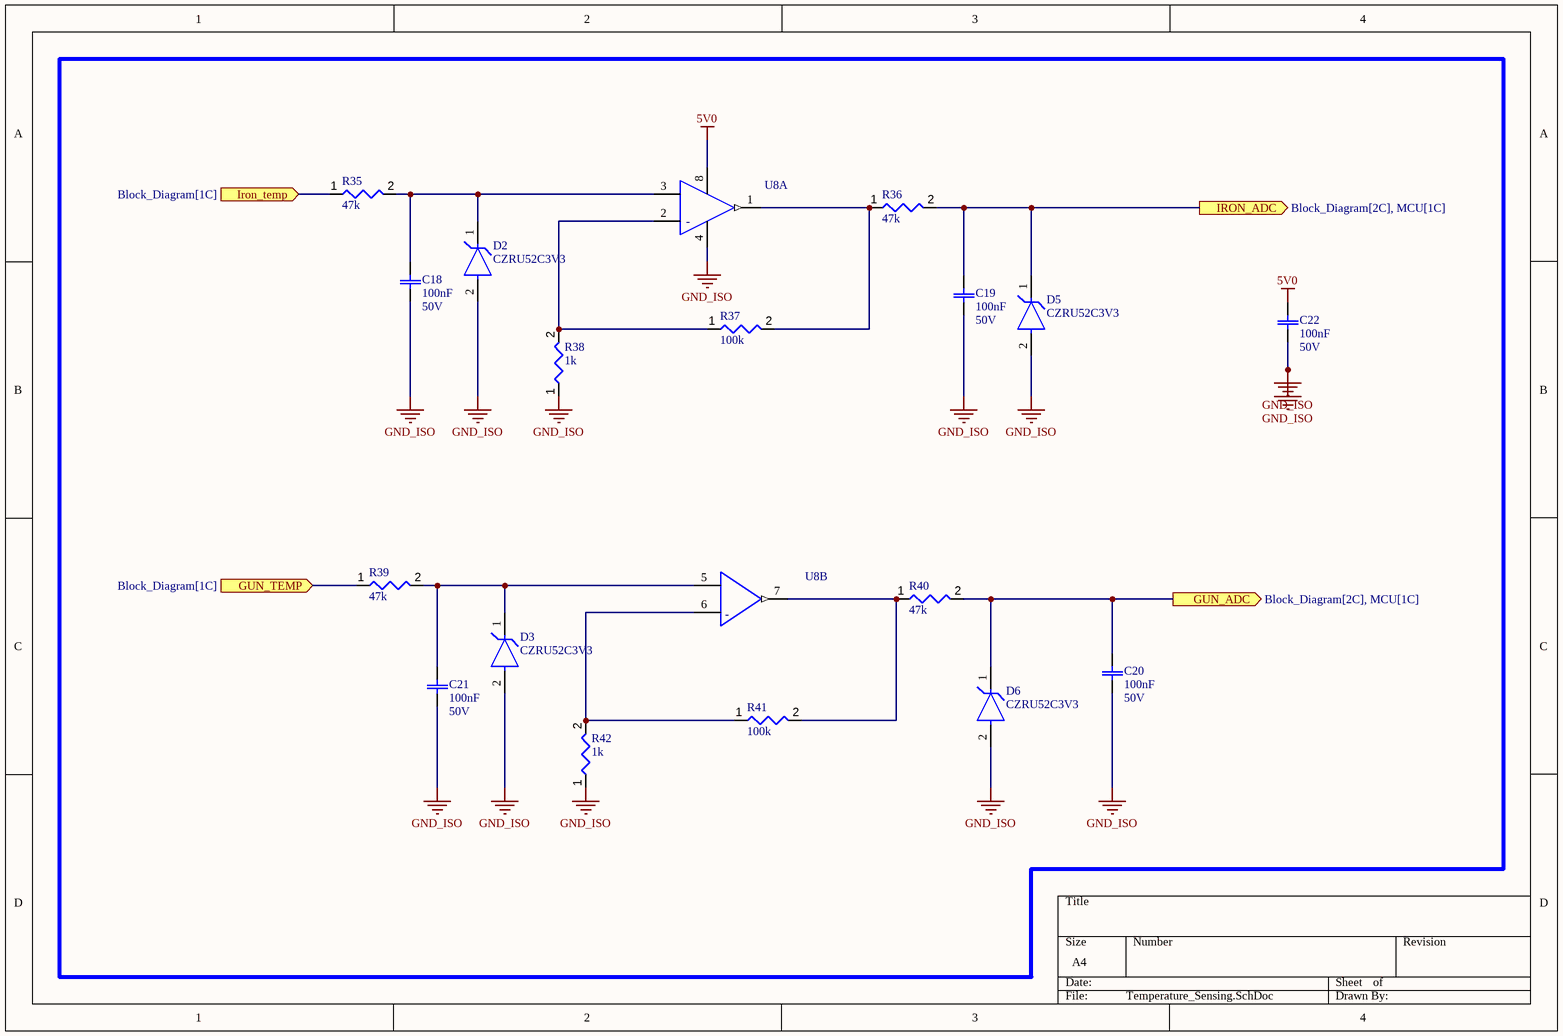
[diagram p2: Temperature_Sensing.SchDoc]

### Parts
C18  value 100nF  Voltage Rating: 50V  [Generic Ceramic 0603 CAP]  (hidden comment: CAP-MLCC_SMD-0603_MR-GCM_u_0.1uF_50V_10%_X8L)
C19  value 100nF  Voltage Rating: 50V  [Generic Ceramic 0603 CAP]  (hidden comment: CAP-MLCC_SMD-0603_MR-GCM_u_0.1uF_50V_10%_X8L)
C20  value 100nF  Voltage Rating: 50V  [Generic Ceramic 0603 CAP]  (hidden comment: CAP-MLCC_SMD-0603_MR-GCM_u_0.1uF_50V_10%_X8L)
C21  value 100nF  Voltage Rating: 50V  [Generic Ceramic 0603 CAP]  (hidden comment: CAP-MLCC_SMD-0603_MR-GCM_u_0.1uF_50V_10%_X8L)
C22  value 100nF  Voltage Rating: 50V  [Generic Ceramic 0603 CAP]  (hidden comment: CAP-MLCC_SMD-0603_MR-GCM_u_0.1uF_50V_10%_X8L)
D2  CZRU52C3V3  [FP-0603-SOD-523F-MFG]
D3  CZRU52C3V3  [FP-0603-SOD-523F-MFG]
D5  CZRU52C3V3  [FP-0603-SOD-523F-MFG]
D6  CZRU52C3V3  [FP-0603-SOD-523F-MFG]
R35  value 47k  [Generic_0603_RES]  (hidden comment: RES-TK_SMD-0603_VIS-CRCW_K_47K_1/10W_1%)
R36  value 47k  [Generic_0603_RES]  (hidden comment: RES-TK_SMD-0603_VIS-CRCW_K_47K_1/10W_1%)
R37  value 100k  [Generic_0603_RES]  (hidden comment: RES-TK_SMD-0603_VIS-CRCW_K_100K_1/10W_1%)
R38  value 1k  [Generic_0603_RES]  (hidden comment: RES-TK_SMD-0603_VIS-CRCW_K_1K_1/10W_1%)
R39  value 47k  [Generic_0603_RES]  (hidden comment: RES-TK_SMD-0603_VIS-CRCW_K_47K_1/10W_1%)
R40  value 47k  [Generic_0603_RES]  (hidden comment: RES-TK_SMD-0603_VIS-CRCW_K_47K_1/10W_1%)
R41  value 100k  [Generic_0603_RES]  (hidden comment: RES-TK_SMD-0603_VIS-CRCW_K_100K_1/10W_1%)
R42  value 1k  [Generic_0603_RES]  (hidden comment: RES-TK_SMD-0603_VIS-CRCW_K_1K_1/10W_1%)
U8  LM358DR  [FP-D0008A-MFG]  (value not drawn)  (parts A,B of 2)

### Ports
GUN_ADC (out, see Block_Diagram[2C], MCU[1C]), GUN_TEMP (in, see Block_Diagram[1C]), IRON_ADC (out, see Block_Diagram[2C], MCU[1C]), Iron_temp (in, see Block_Diagram[1C])

### Nets
5V0: C22.2 U8.8(V+)
GND_ISO: C18.1 C19.1 C20.1 C21.1 C22.1 D2.2(A) D3.2(A) D5.2(A) D6.2(A) R38.1 R42.1 U8.4(V-)
GUN_ADC: C20.2 D6.1(C) R40.2 ; port GUN_ADC
IRON_ADC: C19.2 D5.1(C) R36.2 ; port IRON_ADC
NetC18_2: C18.2 D2.1(C) R35.2 U8.3(IN1+)
NetC21_2: C21.2 D3.1(C) R39.2 U8.5(IN2+)
NetR35_1: R35.1 ; port Iron_temp
NetR36_1: R36.1 R37.2 U8.1(1OUT)
NetR37_1: R37.1 R38.2 U8.2(IN1-)
NetR39_1: R39.1 ; port GUN_TEMP
NetR40_1: R40.1 R41.2 U8.7(2OUT)
NetR41_1: R41.1 R42.2 U8.6(IN2-)

### Notes on the sheet
- (in symbol CMP-1685-00009-2, part A) -
- (in symbol CMP-1685-00009-2, part B) -

### Library data of the parts
C18-C22 = CMP-001-00115-11: as C11 on sheet Connectivity; Automotive: AEQ-200; Min Operating Temperature: -55°C; Case/Package: 0603; Mounting Technology: Surface Mount; RoHS Compliant: Yes; Capacitor Type: Ceramic; Pins: 2; Max Operating Temperature: 150°C
D2 D3 D5 D6 = CMP-20229-000003-1: DIODE ZENER 3.3V 150MW 0603; Zener Current: 5mA; Tolerance: 5%; Output Current: 500mA; Impedance: 95R; Element Configuration: Single; Max Reverse Leakage Current: 25uA; Max Operating Temperature: 125°C; Max Power Dissipation: 150mW; Power Rating: 150mW; Lead Free: Lead Free; Mount: Surface Mount; Packaging: Tape and Reel; Voltage Tolerance: 5%; Power Dissipation: 150mW; Zener Voltage: 3.3V; Min Operating Temperature: -55°C; Case/Package: SMD/SMT; Voltage Rating (DC): 3.3V; Package Quantity: 1
R35 R36 R39 R40 = CMP-009-00207-2: as R2 on sheet MCU; Case/Package: 0603; Max Operating Temperature: 155°C; Voltage Rating: 75V; RoHS Compliant: Yes; Min Operating Temperature: -55°C; Tolerance: 1%; Mounting Technology: Surface Mount; Pins: 2
R37 R41 = CMP-009-00230-4: as R7 on sheet Connectivity; Pins: 2; Max Operating Temperature: 155°C; Mounting Technology: Surface Mount; Case/Package: 0603; RoHS Compliant: Yes; Voltage Rating: 75V; Tolerance: 1%; Min Operating Temperature: -55°C
R38 R42 = CMP-009-00300-1: Fixed Resistor, Metal Glaze/thick Film, 0.1W, 1000ohm, 75V, 1% +/-Tol, 100ppm/Cel, Surface Mount, 0603; Power: 100mW; Mounting Technology: Surface Mount; Max Operating Temperature: 155°C; Pins: 2; Min Operating Temperature: -55°C; Tolerance: 1%; RoHS Compliant: Yes; Case/Package: 0603; Voltage Rating: 75V
U8 = CMP-1685-00009-2: IC OPAMP GP 2 CIRCUIT 8SOIC; Output Current: 30mA; Min Dual Supply Voltage: 1.5V; Input Offset Voltage (Vos): 7mV; Power Supply Rejection Ratio (PSRR): 65dB; Unity Gain Bandwidth Product: 700kHz; Number of Channels: 2; Min Supply Voltage: 3V; Max Dual Supply Voltage: 16V; Dual Supply Voltage: 9V; Max Supply Voltage: 32V; Nominal Supply Current: 1.2mA; Slew Rate: 0.3V/µs; Input Bias Current: 250nA; Voltage Gain: 100dB; Operating Supply Current: 1mA; REACH SVHC: No SVHC; Package Quantity: 2500; Width: 3.91mm; Max Operating Temperature: 70°C; Min Operating Temperature: 0°C; Mount: Surface Mount; Length: 4.9mm; Radiation Hardening: No; Case/Package: SOIC; Lead Free: Lead Free; Number of Elements: 2; Packaging: Tape and Reel; Output Current per Channel: 30mA; Number of Circuits: 2; Bandwidth: 700kHz; Operating Supply Voltage: 16V; Gain Bandwidth Product: 700kHz; Number of Pins: 8; Number of Amplifiers: 2; Height: 1.58mm; Common Mode Rejection Ratio: 65dB; Contact Plating: Gold

## Nets that join several sheets
3V3: MCU (13 pins), Connectivity (11 pins)
5V0: MCU (J1.9 J1.10), Connectivity (D4.1), Temperature_Sensing (C22.2 U8.8)
GND_ISO: MCU (19 pins), Connectivity (24 pins), Temperature_Sensing (12 pins)
B1: MCU (U1.20), Connectivity (C12.2 R8.2)
B2: MCU (U1.46), Connectivity (C13.2 R12.2)
B3: MCU (U1.4), Connectivity (C14.2 R13.2)
B4: MCU (U1.42), Connectivity (C16.2 R15.1 R17.2)
BUZZER: MCU (U1.11), Connectivity (R7.2)
CH_A: MCU (U1.45), Connectivity (C17.2 R18.2 R19.1)
CH_B: MCU (U1.43), Connectivity (C15.2 R14.1 R16.2)
GUN_ADC: MCU (U1.14), Temperature_Sensing (C20.2 D6.1 R40.2)
IRON_ADC: MCU (U1.13), Temperature_Sensing (C19.2 D5.1 R36.2)
USB_N: MCU (U1.32), Connectivity (J2.A7 J2.B7)
USB_P: MCU (R43.1 U1.33), Connectivity (J2.A6 J2.B6)